# EAGLE design MainBoard_V1 (EAGLE 7.3.0)
CNAME: RoboCar Boards; CREVISION: V3.0; DESIGNER: Kaan Inan
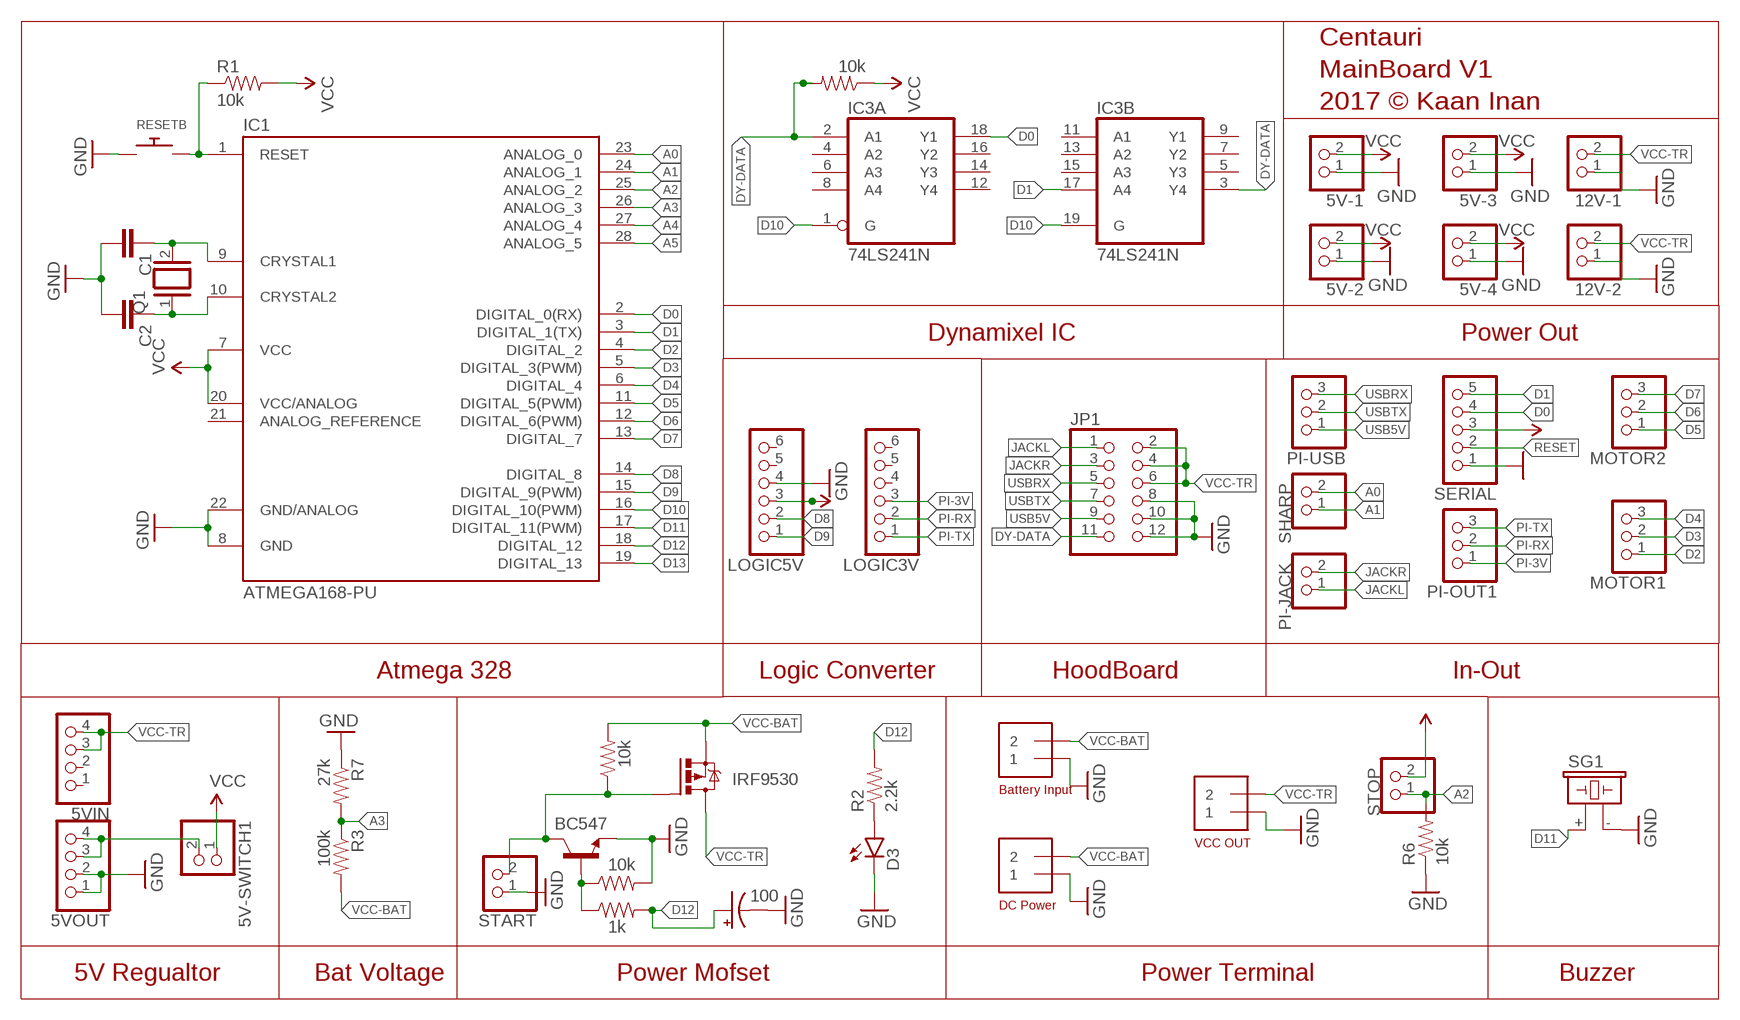
[diagram p0: schematic, sheet 1]

## Parts
5V-1  PINHD-1X2/90  [1X02/90]
5V-2  PINHD-1X2/90  [1X02/90]
5V-3  PINHD-1X2/90  [1X02/90]
5V-4  PINHD-1X2/90  [1X02/90]
5V-SWITCH1  PINHD-1X2  [1X02]
5VIN  PINHD-1X4  [1X04]
5VOUT  PINHD-1X4  [1X04]
12V-1  PINHD-1X2/90  [1X02/90]
12V-2  PINHD-1X2/90  [1X02/90]
C1  0.1UF-50V-20%(PTH)KIT-EZ  [CAP-PTH-SMALL-KIT]
C2  0.1UF-50V-20%(PTH)KIT-EZ  [CAP-PTH-SMALL-KIT]
C7  100  100UF-25V-20%(PTH)  [CPOL-RADIAL-100UF-25V]
D3  LED3MM  [LED3MM]
DC1  1X2-3.5MM  [1X2-3.5MM]
IC1  ATMEGA168-PU  [DIL28-3]
IC3  74LS241N  [DIL20]
JP1  PINHD-2X6  [2X06]
LOGIC3V  PINHD-1X6  [1X06]
LOGIC5V  PINHD-1X6  [1X06]
MOTOR1  PINHD-1X3  [1X03]
MOTOR2  PINHD-1X3  [1X03]
PI-JACK  PINHD-1X2  [1X02]
PI-OUT1  PINHD-1X3  [1X03]
PI-USB  PINHD-1X3  [1X03]
PIL1  1X2-3.5MM  [1X2-3.5MM]
Q1  XTAL/S  [QS]
Q2  IRF9530  [TO220BV]
Q6  BC547  TRANSISTOR_NPN2N3904  [TO-92]
R1  10k  RESISTORAXIAL-0.3  [AXIAL-0.3]
R2  2.2k  RESISTORAXIAL-0.3  [AXIAL-0.3]
R3  100k  RESISTORAXIAL-0.3  [AXIAL-0.3]
R6  10k  RESISTORAXIAL-0.3  [AXIAL-0.3]
R7  27k  RESISTORAXIAL-0.3  [AXIAL-0.3]
R8  10k  RESISTORAXIAL-0.3  [AXIAL-0.3]
R17  10k  RESISTORAXIAL-0.3  [AXIAL-0.3]
R19  10k  RESISTORAXIAL-0.3  [AXIAL-0.3]
R20  1k  RESISTORAXIAL-0.3  [AXIAL-0.3]
RESETB  SWITCH_PUSHBUTTONEVQ-PE  [TACT_PANA-EVQ]
SERIAL  PINHD-1X5  [1X05]
SG1  F/CM12P  [F/CM12P]
SHARP  PINHD-1X2  [1X02]
START  PINHD-1X2  [1X02]
STOP  PINHD-1X2  [1X02]
VCC1  1X2-3.5MM  [1X2-3.5MM]

## Nets
A0: IC1.23(ANALOG_0) SHARP.2
A1: IC1.24(ANALOG_1) SHARP.1
A2: IC1.25(ANALOG_2) R6.P$2 STOP.1
A3: IC1.26(ANALOG_3) R3.P$1 R7.P$2
A4: IC1.27(ANALOG_4)
A5: IC1.28(ANALOG_5)
D0: IC1.2(DIGITAL_0(RX)) IC3.18(A:Y1) SERIAL.4
D1: IC1.3(DIGITAL_1(TX)) IC3.17(B:A4) SERIAL.5
D2: IC1.4(DIGITAL_2) MOTOR1.1
D3: IC1.5(DIGITAL_3(PWM)) MOTOR1.2
D4: IC1.6(DIGITAL_4) MOTOR1.3
D5: IC1.11(DIGITAL_5(PWM)) MOTOR2.1
D6: IC1.12(DIGITAL_6(PWM)) MOTOR2.2
D7: IC1.13(DIGITAL_7) MOTOR2.3
D8: IC1.14(DIGITAL_8) LOGIC5V.2
D9: IC1.15(DIGITAL_9(PWM)) LOGIC5V.1
D10: IC1.16(DIGITAL_10(PWM)) IC3.1(A:G) IC3.19(B:G)
D11: IC1.17(DIGITAL_11(PWM)) SG1.+
D12: C7.1(+) IC1.18(DIGITAL_12) R2.P$2 R20.P$2
D13: IC1.19(DIGITAL_13)
DY-DATA: IC3.2(A:A1) IC3.3(B:Y4) JP1.11 R8.P$2
GND: 5V-1.1 5V-2.1 5V-3.1 5V-4.1 5VOUT.1 5VOUT.2 12V-1.1 12V-2.1 C1.2 C2.2 C7.2(-) D3.K(C) DC1.1 IC1.8(GND) IC1.22(GND/ANALOG) JP1.8 JP1.10 JP1.12 LOGIC5V.4 PIL1.1 Q6.3(E) R6.P$1 R7.P$1 R19.P$2 RESETB.P$1 SERIAL.1 SG1.- START.1 VCC1.1
JACKL: JP1.1 PI-JACK.1
JACKR: JP1.3 PI-JACK.2
N$2: C1.1 IC1.9(CRYSTAL1) Q1.2
N$3: C2.1 IC1.10(CRYSTAL2) Q1.1
N$6: D3.A R2.P$1
N$10: 5V-SWITCH1.2 5VOUT.3 5VOUT.4
N$14: Q2.G Q6.1(C) R17.P$1 START.2
N$20: Q6.2(B) R19.P$1 R20.P$1
PI-3V: LOGIC3V.3 PI-OUT1.1
PI-RX: LOGIC3V.2 PI-OUT1.2
PI-TX: LOGIC3V.1 PI-OUT1.3
RESET: IC1.1(RESET) R1.P$1 RESETB.P$2 SERIAL.2
USB5V: JP1.9 PI-USB.1
USBRX: JP1.5 PI-USB.3
USBTX: JP1.7 PI-USB.2
VCC: 5V-1.2 5V-2.2 5V-3.2 5V-4.2 5V-SWITCH1.1 IC1.7(VCC) IC1.20(VCC/ANALOG) LOGIC5V.3 R1.P$2 R8.P$1 SERIAL.3 STOP.2
VCC-BAT: DC1.2 PIL1.2 Q2.S R3.P$2 R17.P$2
VCC-TR: 5VIN.3 5VIN.4 12V-1.2 12V-2.2 JP1.2 JP1.4 JP1.6 Q2.D VCC1.2
Unconnected: 5VIN.1 5VIN.2 IC1.21(ANALOG_REFERENCE) IC3.4(A:A2) IC3.5(B:Y3) IC3.6(A:A3) IC3.7(B:Y2) IC3.8(A:A4) IC3.9(B:Y1) IC3.11(B:A1) IC3.12(A:Y4) IC3.13(B:A2) IC3.14(A:Y3) IC3.15(B:A3) IC3.16(A:Y2) LOGIC3V.4 LOGIC3V.5 LOGIC3V.6 LOGIC5V.5 LOGIC5V.6

## Notes on the sheet
- Centauri
  MainBoard V1
  2017 © Kaan Inan
- Dynamixel IC | Power Out
- Atmega 328 | Logic Converter | HoodBoard | In-Out
- Battery Input
- VCC OUT
- DC Power
- 5V Regualtor | Bat Voltage | Power Mofset | Power Terminal | Buzzer

## Power pins joined to a net without a drawn wire
GND: IC3.10(P:GND)
VCC: IC3.20(P:VCC)

## Library data of the parts
5V-1-5V-4 5V-SWITCH1 12V-1 12V-2 PI-JACK SHARP START STOP = pinhead:PINHD-1X2: PIN HEADER
5VIN 5VOUT = pinhead:PINHD-1X4: PIN HEADER
C1 C2 = SparkFun-Capacitors:0.1UF-50V-20%(PTH): CAP-08370; PROD_ID: CAP-08370
C7 = SparkFun-Cap:100UF-25V-20%(PTH): CAP-08439; PROD_ID: CAP-08439
D3 = SparkFun-LED:LED: LEDs Standard schematic elements and footprints for 5mm, 3mm, 1206, and 0603 sized LEDs. 5mm - Spark Fun Electronics SKU : COM-00529 (and others)
DC1 PIL1 VCC1 = adafruit:1X2: 3.5mm Terminal block http://www.ladyada.net/library/pcb/eaglelibrary.html
IC1 = Arduino-AVR:ATMEGA168-PU
IC3 = 74xx-eu:74*241: Octal BUFFER and LINE DRIVER, 3-state
JP1 = pinhead:PINHD-2X6: PIN HEADER
LOGIC3V LOGIC5V = pinhead:PINHD-1X6: PIN HEADER
MOTOR1 MOTOR2 PI-OUT1 PI-USB = adafruit:PINHD-1X3: PIN HEADER
Q1 = special:XTAL/S: CRYSTAL
Q2 = transistor-power:IRF9530: P-CHANNEL HEXFET POWER-MOS-FET Source: http://www.irf.com/product-info/datasheets/data/irf9530.pdf
Q6 = SparkFun-DiscreteSemi:TRANSISTOR_NPN: Generic NPN BJT MMBT2222A - TRANS-08049 (SOT-23, 1A 40V) MPSA42 - TRANS-09116 (SOT-23, 500mA 300V) MMBT5088LT1G - TRANS-11160 (SOT-23, 50 mA 30V) BC547 - COM-08928 <http://www.sparkfun.com/products/8928> (TO-92 45V 100mA) (1.Collector 2.Base 3.Emitter) 2N3904 - COM-00521 <http://www.sparkfun.com/products/521> (TO-92 40V 200mA) (1.Emitter 2.Base 3.Collector) P2N2222A - COM-12852 <http://www.sparkfun.com/products/12852> (TO-92 40V 600mA) (1.Collector 2.Base 3.Emitter); PROD_ID: TRANS-08447
R1-R3 R6-R8 R17 R19 R20 = SparkFun-Passives:RESISTOR: Resistor Basic schematic elements and footprints for 0603, 1206, and PTH resistors.
RESETB = adafruit:SWITCH_PUSHBUTTON: Buttons SOFTTOUCHSMD_SJ - Soft touch temporary push button (Super Junk Akihabara) Compatible with SKPMANE010 [Mouser: 688-SKPMAN] C&K_KSS = Digikey: KSS221GLFS
SERIAL = pinhead:PINHD-1X5: PIN HEADER
SG1 = buzzer:F/CM12P: BUZZER Source: Buerklin; OC_FARNELL: unknown; OC_NEWARK: unknown

## Net classes
0 default: width 0.1 mm, drill 1 mm

## Board
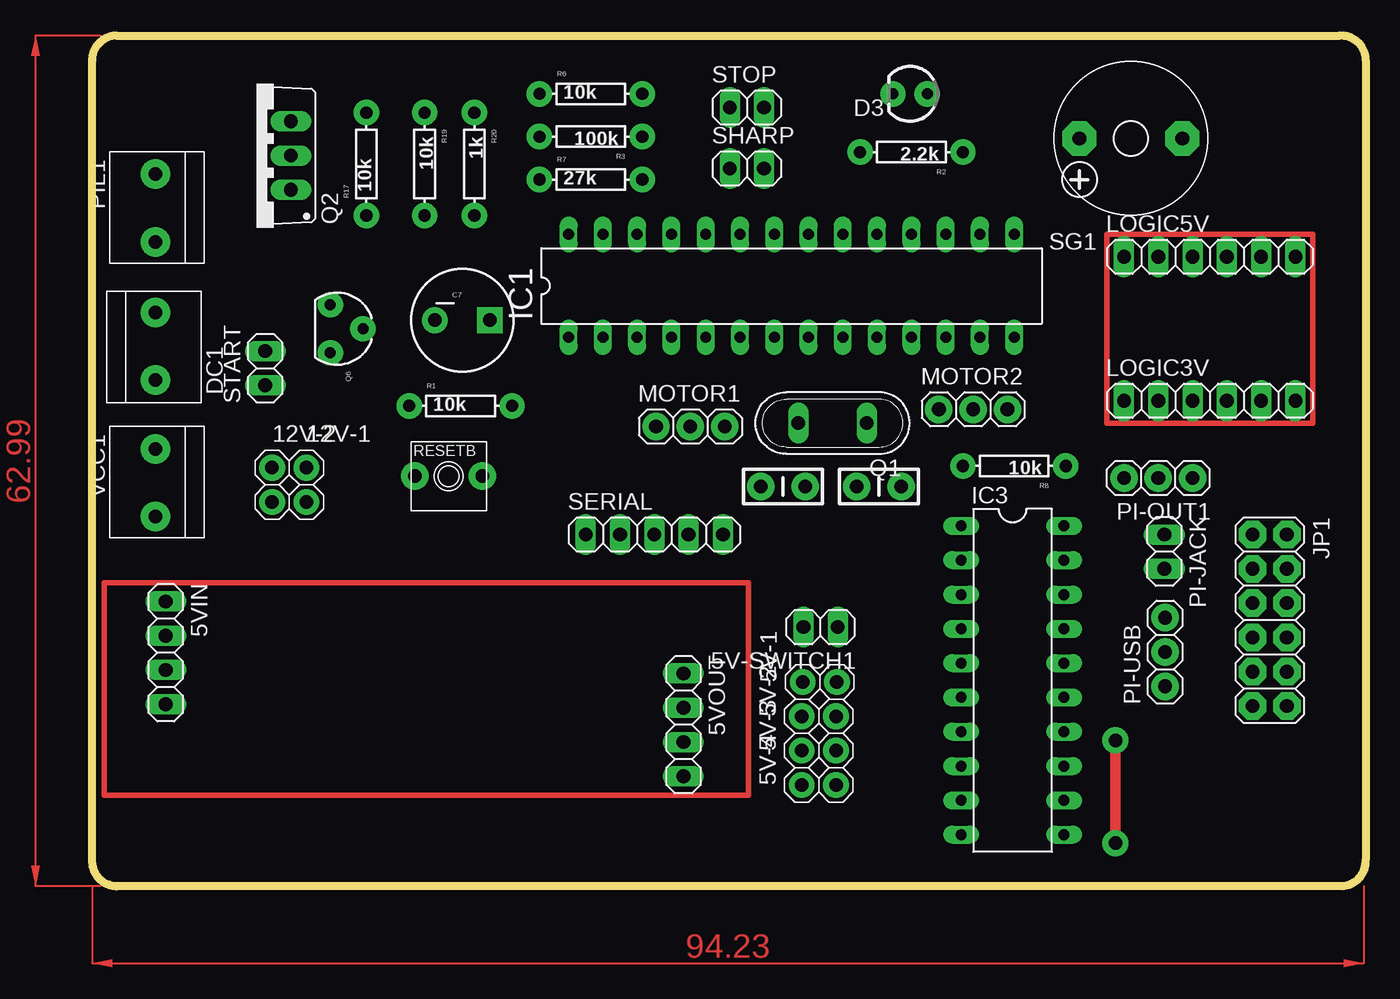
[diagram p1: board, top side]
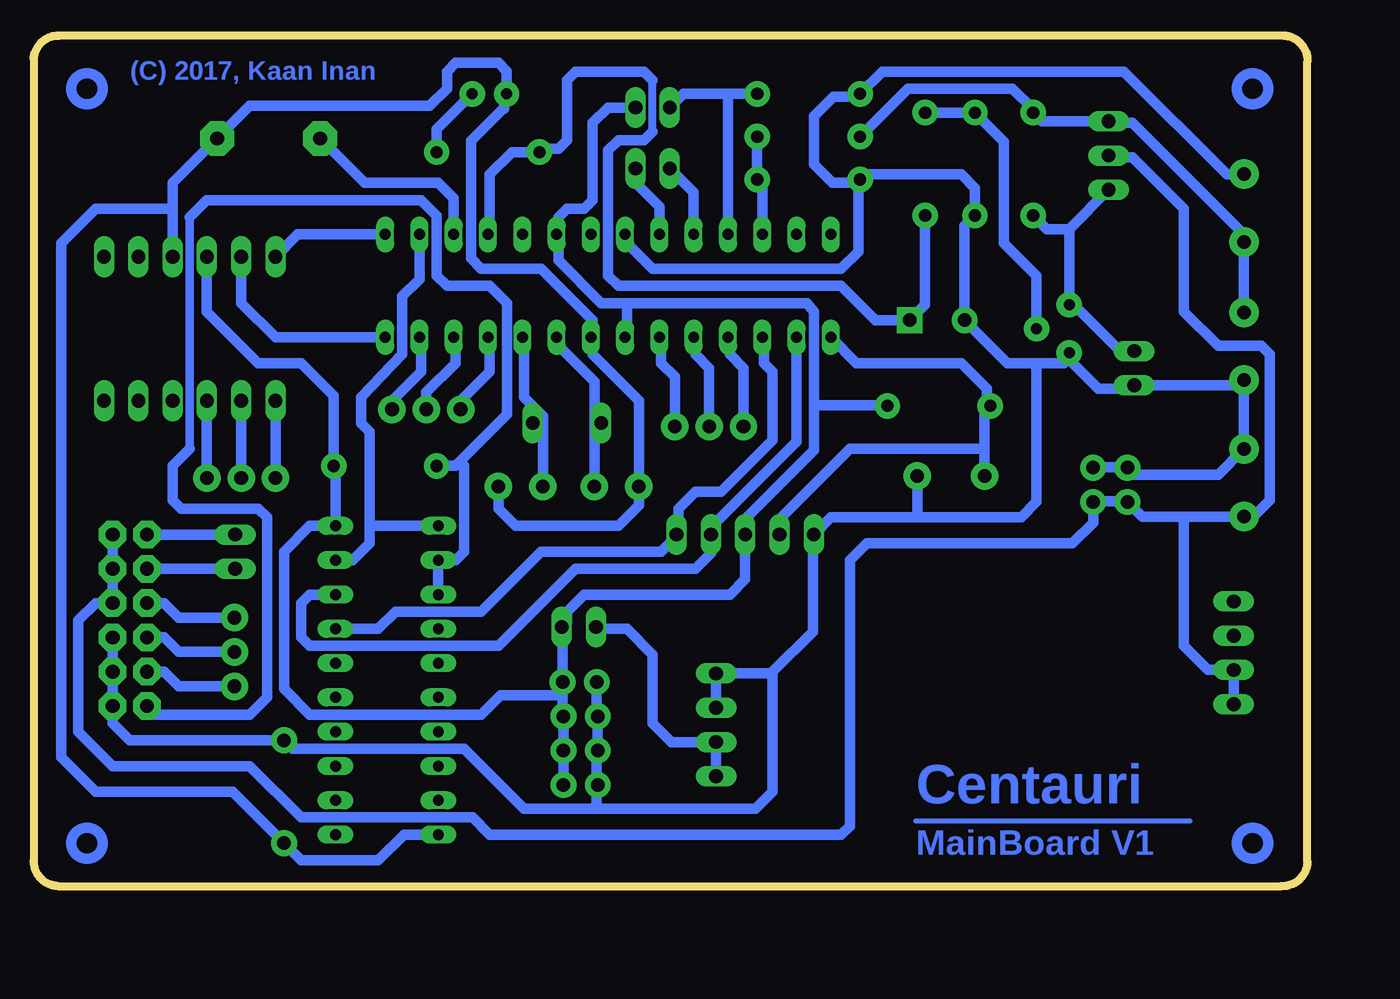
[diagram p2: board, bottom side, seen from below]

Size 94.36 x 62.99 mm. Coordinates in mm from the lower left corner, seen from the top.
Outline: 1.78,62.99 92.46,62.99 arc-90 94.36,61.21 94.36,1.91 arc-90 92.58,0 1.91,0 arc-90 0,1.78 0,61.09 arc-90 1.78,62.99
Copper layers (1*16): Top 0.035mm / dielectric 1.5mm / Bottom 0.035mm
Design rules "default": minimum track width 10mil, minimum drill 24mil, track to track 8mil, track to pad 8mil, pad to pad 8mil, via to via 8mil, smd to smd 8mil, copper to edge 40mil, drill to drill 8mil, minimum pad ring 10mil, minimum via ring 8mil, stop-mask expansion 4mil, vias tented up to drill 0mil, thermal gap 10mil

### Footprints (pad centres in the part's own frame; a part is rotated, then mirrored left to right if it is on the bottom)
1X02/90 = drill 1 pad 1.905: 1 0,0; 2 2.54,0
1X02 = drill 1.016 long: 1 -1.27,0; 2 1.27,0
1X04 = drill 1.016 long: 1 -3.81,0; 2 -1.27,0; 3 1.27,0; 4 3.81,0
CAP-PTH-SMALL-KIT = drill 1.016 pad 2.032: 1 -1.905,0; 2 1.397,0
CPOL-RADIAL-100UF-25V = drill 1 pad 1.905 square: 1 2.032,0 | drill 1 pad 1.905: 2 -2.032,0
LED3MM = drill 0.813 pad 1.88: A -1.27,0; K 1.27,0
1X2-3.5MM = drill 1 pad 2.184: 1 1.927,0; 2 -3.097,0
DIL28-3 = drill 0.813 long: 1 -16.51,-3.81; 2 -13.97,-3.81; 3 -11.43,-3.81; 4 -8.89,-3.81; 5 -6.35,-3.81; 6 -3.81,-3.81; 7 -1.27,-3.81; 8 1.27,-3.81; 9 3.81,-3.81; 10 6.35,-3.81; 11 8.89,-3.81; 12 11.43,-3.81; 13 13.97,-3.81; 14 16.51,-3.81; 15 16.51,3.81; 16 13.97,3.81; 17 11.43,3.81; 18 8.89,3.81; 19 6.35,3.81; 20 3.81,3.81; 21 1.27,3.81; 22 -1.27,3.81; 23 -3.81,3.81; 24 -6.35,3.81; 25 -8.89,3.81; 26 -11.43,3.81; 27 -13.97,3.81; 28 -16.51,3.81
DIL20 = drill 0.813 long: 1 -11.43,-3.81; 2 -8.89,-3.81; 3 -6.35,-3.81; 4 -3.81,-3.81; 5 -1.27,-3.81; 6 1.27,-3.81; 7 3.81,-3.81; 8 6.35,-3.81; 9 8.89,-3.81; 10 11.43,-3.81; 11 11.43,3.81; 12 8.89,3.81; 13 6.35,3.81; 14 3.81,3.81; 15 1.27,3.81; 16 -1.27,3.81; 17 -3.81,3.81; 18 -6.35,3.81; 19 -8.89,3.81; 20 -11.43,3.81
2X06 = drill 1.016 pad 2.032 octagon: 1 -6.35,-1.27; 2 -6.35,1.27; 3 -3.81,-1.27; 4 -3.81,1.27; 5 -1.27,-1.27; 6 -1.27,1.27; 7 1.27,-1.27; 8 1.27,1.27; 9 3.81,-1.27; 10 3.81,1.27; 11 6.35,-1.27; 12 6.35,1.27
1X06 = drill 1.016 long: 1 -6.35,0; 2 -3.81,0; 3 -1.27,0; 4 1.27,0; 5 3.81,0; 6 6.35,0
1X03 = drill 1.016 pad 2.032: 1 -2.54,0; 2 0,0; 3 2.54,0
QS = drill 1 long: 1 -2.54,0; 2 2.54,0
TO220BV = drill 1.016 long: D 0,-2.54; G -2.54,-2.54; S 2.54,-2.54
TO-92 = drill 0.813 pad 1.88: 1 -1.778,-0.508; 2 0,1.905; 3 1.778,-0.508
AXIAL-0.3 = drill 0.9 pad 1.88: P$1 -3.81,0; P$2 3.81,0
TACT_PANA-EVQ = drill 1 pad 2.032: P$1 0.052,0; P$2 5.028,0
1X05 = drill 1.016 long: 1 -5.08,0; 2 -2.54,0; 3 0,0; 4 2.54,0; 5 5.08,0
F/CM12P = drill 1.016 pad 2.54 octagon: + 3.81,0; - -3.81,0

### Placement (x,y rotation side)
5V-1  52.64,15.11 0 top
5V-2  52.58,12.57 0 top
5V-3  52.58,10.03 0 top
5V-4  52.58,7.49 0 top
5V-SWITCH1  53.98,19.18 180 top
5VIN  5.46,17.27 270 top
5VOUT  43.81,11.94 270 top
12V-1  15.88,30.99 270 top
12V-2  13.33,30.99 270 top
C1  50.93,29.59 180 top
C2  58.55,29.59 0 top
C7  27.43,41.91 0 top
D3  60.6,58.67 180 top
DC1  4.7,39.4 270 top
IC1  51.82,44.45 0 top
IC3  68.2,15.24 270 top
JP1  87.25,19.69 270 top
LOGIC3V  82.8,35.94 0 top
LOGIC5V  82.8,46.61 0 top
MOTOR1  44.32,34.04 0 top
MOTOR2  65.28,35.31 0 top
PI-JACK  79.44,24.77 270 top
PI-OUT1  78.99,30.23 180 top
PI-USB  79.5,17.34 90 top
PIL1  4.7,50.8 90 top
Q1  54.86,34.29 180 top
Q2  12.19,54.1 90 top
Q6  18.16,41.27 270 top
R1  27.3,35.56 0 top
R2  60.71,54.36 180 top
R3  36.96,55.5 180 top
R6  36.96,58.67 0 top
R7  36.96,52.32 0 top
R8  68.33,31.12 180 top
R17  20.32,53.47 90 top
R19  24.64,53.47 270 top
R20  28.32,53.47 270 top
RESETB  28.96,30.35 180 top
SERIAL  41.66,26.04 0 top
SG1  76.96,55.37 180 top
SHARP  48.51,53.15 0 top
START  12.83,38.35 90 top
STOP  48.51,57.66 0 top
VCC1  4.7,30.45 90 top

### Tracks (layer width: path | path; a pad name or v marks a point on that pad's centre or on a via)
A0
  Bottom 0.762: IC1.23 48.01,50.29 49.78,52.07 SHARP.2
A1
  Bottom 0.762: IC1.24 45.47,51.37 SHARP.1
A2
  Bottom 0.762: IC1.25 42.93,58.55 42.8,58.67 | R6.P$2 42.8,58.67 | 42.8,58.67 46.23,58.67 STOP.1
A3
  Bottom 0.762: IC1.26 40.39,51.94 R7.P$2 R3.P$1
D0
  Bottom 0.254: 44.2,26.01 SERIAL.4
  Bottom 0.762: IC1.2 37.85,32.89 44.07,26.67 44.07,26.16 SERIAL.4 | 44.2,26.01 44.2,24.64 45.34,23.5 54.23,23.5 59.94,17.78 73.91,17.78 74.55,18.42 74.55,20.96 73.91,21.59 IC3.18
D1
  Bottom 0.254: 46.94,26.01 SERIAL.5
  Bottom 0.762: IC1.3 40.26,40.64 40.26,38.73 39.62,38.1 39.62,33.02 43.43,29.21 45.34,29.21 46.61,27.94 46.61,26.16 SERIAL.5 | 46.94,26.01 46.94,25.71 47.88,24.77 56.77,24.77 61.21,20.32 67.56,20.32 68.83,19.05 IC3.17
D2
  Bottom 0.762: MOTOR1.1 41.78,38.35 42.8,39.37 42.8,40.51 IC1.4
D3
  Bottom 0.762: MOTOR1.2 44.32,38.35 45.34,39.37 45.34,40.51 IC1.5
D4
  Bottom 0.762: MOTOR1.3 46.86,37.72 47.88,38.73 47.88,40.51 IC1.6
D5
  Bottom 0.762: MOTOR2.1 62.74,35.94 60.58,38.1 60.58,40.51 IC1.11
D6
  Bottom 0.762: MOTOR2.2 65.28,36.58 63.12,38.73 63.12,40.51 IC1.12
D7
  Bottom 0.762: MOTOR2.3 67.82,35.94 65.66,38.1 65.66,40.51 IC1.13
D8
  Bottom 0.762: IC1.14 76.45,40.64 78.99,43.18 LOGIC5V.2
D9
  Bottom 0.762: IC1.15 74.8,48.26 LOGIC5V.1
D10
  Bottom 0.762: IC3.19 70.74,24.13 69.47,25.4 69.47,26.67 | 69.47,26.67 69.47,33.66 70.1,34.29 70.1,36.2 67.06,39.37 67.06,43.69 65.79,44.96 IC1.16 | IC3.1 69.47,26.67
D11
  Bottom 0.762: SG1.+ 69.85,52.07 64.39,52.07 63.25,50.93 IC1.17
D12
  Bottom 0.61: 48.51,55.88 48.51,59.69
  Bottom 0.762: 48.51,55.88 49.15,55.24 51.05,55.24 51.82,54.48 51.82,45.21 51.05,44.45 34.54,44.45 32,41.91 C7.1 28.32,43.05 R20.P$2 | 48.51,59.69 49.15,60.32 54.23,60.32 54.86,59.69 54.86,55.24 55.5,54.61 56.64,54.61 R2.P$2 58.93,54.36 60.58,52.7 60.58,48.39 IC1.18
DY-DATA
  Bottom 0.254: 64.31,31.27 R8.P$2
  Bottom 0.635: 82.8,49.53 82.8,32.38
  Bottom 0.762: 82.8,49.53 81.53,50.8 65.66,50.8 64.52,49.66 64.52,45.21 63.75,44.45 60.58,44.45 59.31,43.18 59.31,34.92 62.8,31.43 | IC3.3 IC3.2 63.12,24.13 62.48,24.77 62.48,31.12 62.8,31.43 | 82.8,32.38 84.07,31.12 84.07,28.58 83.44,27.94 77.72,27.94 77.09,27.31 77.09,13.97 78.36,12.7 85.34,12.7 JP1.11 | 62.8,31.43 63.12,31.12 R8.P$2
GND  (via drill 1 pad 1.91)
  Top 0.762: v75.82,3.17 v75.82,10.79
  Bottom 0.254: 80.77,55.27 SG1.- | 53.11,40.64 IC1.8 | 50.37,48.18 IC1.22 | 33.22,58.47 R6.P$1 | 13.36,31.01 12V-2.1 | 15.88,31.01 12V-1.1 | 52.65,10.01 5V-3.1 52.65,10.24 | 52.65,15.04 5V-1.1 | 52.65,12.75 5V-2.1 | 36.65,26.01 SERIAL.1 | 52.65,8.18 52.65,7.49 5V-4.1 52.65,8.18
  Bottom 0.762: PIL1.1 5.99,52.73 13.59,60.32 31.5,60.32 R6.P$1 | 24.77,49.53 R19.P$2 | R19.P$2 24.64,51.69 25.65,52.7 32.77,52.7 R7.P$1 | 33.22,58.47 35.13,58.47 36.58,57.02 36.58,53.47 35.18,52.07 33.4,52.07 R7.P$1 | 13.36,31.01 15.85,31.01 12V-1.1 | IC1.22 50.42,48.13 50.42,47.62 48.51,45.72 34.54,45.72 33.27,46.99 33.27,52.2 R7.P$1 | 52.65,15.04 52.65,12.65 5V-2.1 52.58,10.79 | 52.58,10.79 5V-3.1 | 52.65,10.01 52.65,7.57 5V-4.1 | 52.45,10.67 52.58,10.79 | 80.9,55.5 SG1.- | 52.65,7.49 52.65,6.02 52.96,5.71 | LOGIC5V.4 84.07,50.16 | 84.07,50.16 84.07,52.07 SG1.- | IC3.10 66.93,3.81 68.83,1.91 74.55,1.91 v75.82,3.17 79.63,6.98 89.79,6.98 92.33,9.53 92.33,47.62 89.79,50.16 84.07,50.16 | SG1.- 78.36,57.78 65.02,57.78 63.75,59.05 63.75,60.32 63.12,60.96 59.94,60.96 59.33,60.35 D3.K 59.51,58.5 59.51,57.58 59.58,57.58 61.98,55.18 61.98,46.48 61.21,45.72 56.77,45.72 52.96,41.91 52.96,40.77 IC1.8 52.96,40.51 52.96,39.37 49.53,35.94 C1.2 49.53,28.19 51.05,26.67 58.67,26.67 59.94,27.94 C2.2 | 36.65,26.01 36.65,18.85 39.62,15.88 | 52.96,5.71 58.04,5.71 62.48,10.16 75.18,10.16 v75.82,10.79 87.25,10.79 88.52,12.06 JP1.12 JP1.10 JP1.8 | 52.96,5.71 40.89,5.71 39.62,6.98 39.62,15.88 | 5VOUT.2 5VOUT.1 39.75,15.75 39.62,15.88 | 12V-2.1 12.83,30.48 6.6,30.48 VCC1.1 DC1.1 5.08,37.08 12.32,37.08 | START.1 12.32,37.08 | 12.32,37.08 12.57,36.83 15.49,36.83 17.65,38.99 Q6.3 17.65,39.12 18.03,38.73 19.94,38.73 | 19.94,38.73 22.23,38.73 C7.2 25.4,48.89 R19.P$2 | 19.94,38.73 20.07,38.61 20.07,28.45 21.21,27.31 28.83,27.31 | 28.83,27.31 35.31,27.31 SERIAL.1 | RESETB.P$1 28.9,27.38 28.83,27.31
JACKL
  Bottom 0.762: PI-JACK.1 JP1.1
JACKR
  Bottom 0.762: PI-JACK.2 JP1.3
N$1
  Top 0.406: 48.64,6.73 0.89,6.73 0.89,22.48 48.64,22.48 48.64,6.73
N$2
  Bottom 0.762: C1.1 52.83,34.29 | 52.83,34.29 52.83,37.34 55.5,40 55.5,40.51 IC1.9 | Q1.2 52.83,34.29
N$3
  Bottom 0.762: C2.1 56.64,34.29 | 56.64,34.29 56.64,34.8 58.04,36.2 58.04,40.51 IC1.10 | Q1.1 56.64,34.29
N$4
  Bottom 0.381: 29.02,4.83 8.7,4.83
N$5
  Top 0.406: 90.42,48.26 90.42,34.29 75.18,34.29 75.18,48.26 90.42,48.26
N$6
  Bottom 0.762: R2.P$1 64.52,56.03 D3.A
N$10
  Bottom 0.762: 5VOUT.4 5VOUT.3 47.12,10.67 48.51,12.06 48.51,17.15 50.42,19.05 52.58,19.05 5V-SWITCH1.2
N$14
  Bottom 0.762: 17.65,48.64 Q2.G | 17.65,48.64 19.3,48.64 R17.P$1 | START.2 13.84,39.62 17.4,43.18 17.53,43.18 Q6.1 17.65,48.64
N$20
  Bottom 0.762: R20.P$1 R19.P$1 22.48,55.12 22.48,47.62 20.07,45.21 Q6.2
PI-3V
  Bottom 0.762: PI-OUT1.1 LOGIC3V.3
PI-RX
  Bottom 0.762: PI-OUT1.2 LOGIC3V.2
PI-TX
  Bottom 0.762: PI-OUT1.3 LOGIC3V.1
RESET
  Bottom 0.254: 23.98,30.35 RESETB.P$2
  Bottom 0.762: RESETB.P$2 23.93,32.38 | 23.93,32.38 23.93,35.13 R1.P$1 23.75,35.81 23.75,36.83 25.65,38.73 33.4,38.73 IC1.1 | SERIAL.2 39.12,27.18 33.91,32.38 23.93,32.38
USB5V
  Bottom 0.762: PI-USB.1 83.63,14.8 84.71,15.88 JP1.9
USBRX
  Bottom 0.762: PI-USB.3 83.63,19.88 84.71,20.96 JP1.5
USBTX
  Bottom 0.762: PI-USB.2 83.63,17.34 84.71,18.42 JP1.7
VCC
  Bottom 0.254: 50.6,40.64 IC1.7 | 55.17,15.04 5V-1.2 | 55.17,12.75 5V-2.2 | 41.45,26.24 SERIAL.3 | 31.06,35.38 R1.P$2 31.29,35.61 | 72.08,26.14 72.08,26.59 IC3.20
  Bottom 0.762: 5V-4.2 5V-3.2 5V-2.2 | 55.17,12.75 55.17,14.12 | 55.17,14.12 55.17,15.1 5V-1.2 55.18,19.11 5V-SWITCH1.1 54.86,19.56 54.86,20.32 53.59,21.59 42.8,21.59 41.66,22.73 SERIAL.3 41.53,26.16 41.53,27.31 36.58,32.26 36.58,35.56 | 50.42,43.18 37.08,43.18 36.58,42.54 36.58,35.56 | 50.42,43.18 50.42,40.77 IC1.7 | 50.42,43.18 52.32,43.18 55.5,46.35 55.5,48.13 IC1.20 55.5,48.39 55.5,49.53 54.86,50.16 53.59,50.16 52.96,50.8 52.96,56.52 51.82,57.66 STOP.2 | LOGIC5V.3 81.53,42.54 77.72,38.73 74.55,38.73 72.14,36.32 R8.P$1 72.01,30.99 IC3.20 73.91,26.67 75.82,24.77 75.82,14.61 73.91,12.7 61.21,12.7 59.79,14.12 55.17,14.12 | 31.29,35.61 36.52,35.61 36.58,35.56
VCC-BAT
  Bottom 0.762: R3.P$2 29.59,59.05 21.84,59.05 20.32,57.53 R17.P$2 19.68,56.64 Q2.S 14.61,56.52 12.95,56.52 4.7,48.26 PIL1.2 DC1.2
VCC-TR
  Bottom 0.762: Q2.D 14.61,53.98 12.95,53.98 9.14,50.16 9.14,42.54 6.6,40 3.43,40 2.79,39.37 2.79,28.58 4.01,27.36 VCC1.2 9.14,27.36 | 13.28,28.5 12V-2.2 | 5VIN.4 5VIN.3 7.37,16 9.14,17.78 9.14,27.36 | 12V-2.2 13.39,28.5 15.82,28.5 12V-1.2 15.88,26.92 17.4,25.4 32.64,25.4 33.91,24.13 33.91,4.45 34.54,3.81 60.58,3.81 61.85,5.08 74.55,5.08 78.36,8.89 88.52,8.89 91.06,11.43 91.06,19.69 89.79,20.96 JP1.6 JP1.4 JP1.2 | 9.14,27.36 12.24,27.36 12V-2.2
(copper drawn outside any net)
  shapes: Bottom circle x4, Top area x2

### Text on the board
Bottom: (C) 2017, Kaan Inan | Centauri | MainBoard V1